# Altium schematic sheet Arduino_ESP8266_SHT21_BH1750.SchDoc
size A
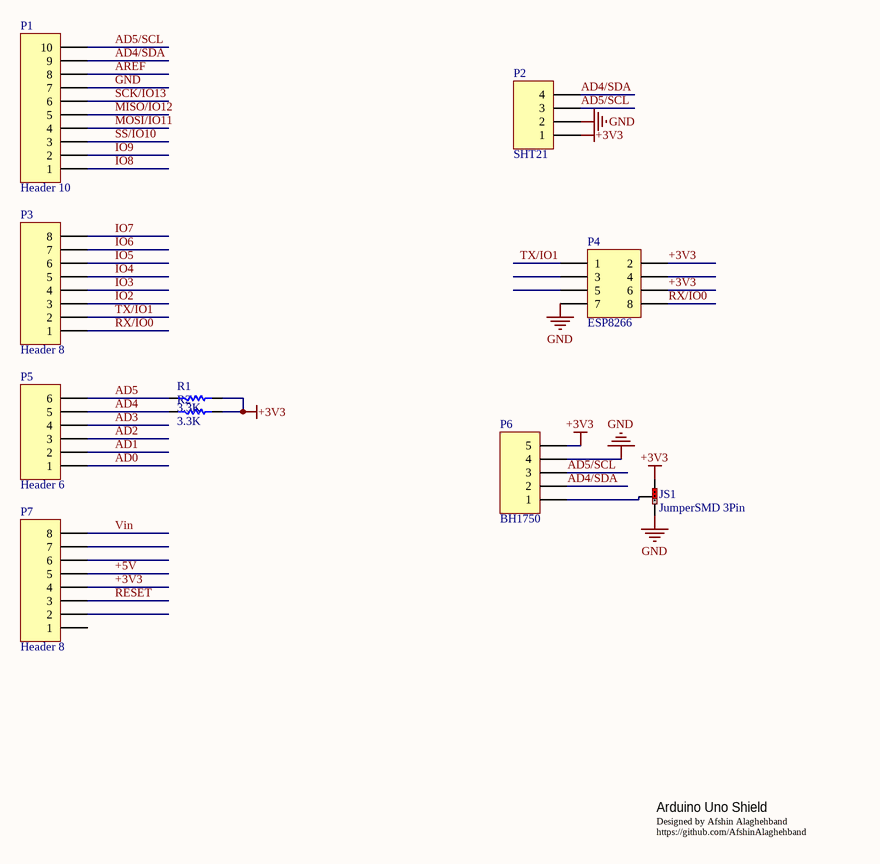
[diagram p0: Arduino_ESP8266_SHT21_BH1750.SchDoc]

## Parts
JS1  JumperSMD 3Pin  [JumperSMD 3Pin - UltraSmall]
P1  Header 10  [HDR1X10]
P2  SHT21  [HDR1X4]
P3  Header 8  [HDR1X8]
P4  ESP8266  [HDR2X4]
P5  Header 6  [HDR1X6]
P6  BH1750  [HDR1X5]
P7  Header 8  [HDR1X8]
R1  3.3K  [RES 0805 (2012X06L)]
R2  3.3K  [RES 0805 (2012X06L)]

## Nets
+3V3: JS1.3 P2.1 P4.2 P4.6 P6.5 P7.4 R1.2 R2.2
GND: JS1.1 P1.7 P2.2 P4.7 P6.4
+5V: P7.5
AD0: P5.1
AD1: P5.2
AD2: P5.3
AD3: P5.4
AD4: P5.5 R2.1
AD4/SDA: P1.9 P2.4 P6.2
AD5: P5.6 R1.1
AD5/SCL: P1.10 P2.3 P6.3
AREF: P1.8
IO2: P3.3
IO3: P3.4
IO4: P3.5
IO5: P3.6
IO6: P3.7
IO7: P3.8
IO8: P1.1
IO9: P1.2
MISO/IO12: P1.5
MOSI/IO11: P1.4
RESET: P7.3
RX/IO0: P3.1 P4.8
SCK/IO13: P1.6
SS/IO10: P1.3
TX/IO1: P3.2 P4.1
Vin: P7.8
NetJS1_2: JS1.2 P6.1

Not connected (* = marked no-connect by the designer): P4 3 4 5; P7 1 2 6 7

## Notes on the sheet
- Arduino Uno Shield
- Designed by Afshin Alaghehband https://github.com/AfshinAlaghehband

## Library data of the parts
P1 = Header 10: Header, 10-Pin; LatestRevisionDate: 17-Jul-2002; LatestRevisionNote: Re-released for DXP Platform.; Publisher: Altium Limited
P2 = Header 4: SHT21 temperature and humidity sensor; LatestRevisionDate: 17-Jul-2002; LatestRevisionNote: Re-released for DXP Platform.; Publisher: Altium Limited
P3 P7 = Header 8: Header, 8-Pin; LatestRevisionDate: 17-Jul-2002; LatestRevisionNote: Re-released for DXP Platform.; Publisher: Altium Limited
P4 = Header 4X2: ESP8266-01; LatestRevisionDate: 17-Jul-2002; LatestRevisionNote: Re-released for DXP Platform.; Publisher: Altium Limited
P5 = Header 6: Header, 6-Pin; LatestRevisionDate: 17-Jul-2002; LatestRevisionNote: Re-released for DXP Platform.; Publisher: Altium Limited
P6 = Header 5: BH1750 Ambient Light Sensor; LatestRevisionDate: 17-Jul-2002; LatestRevisionNote: Re-released for DXP Platform.; Publisher: Altium Limited
R1 R2 = Resistor: Tolerance: 5%; Power: 1/8 W; Value: 3.3K